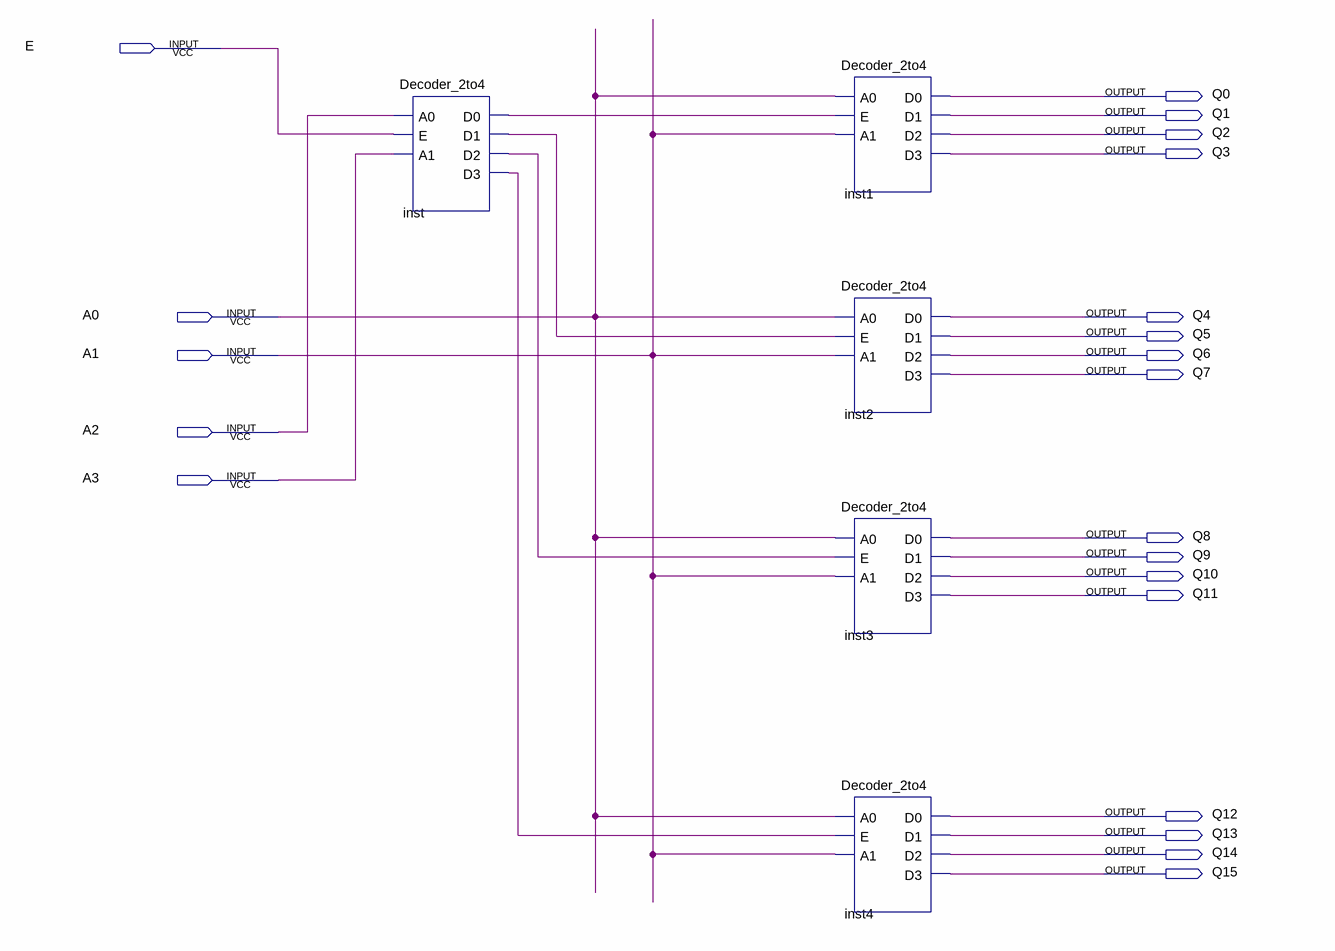
[diagram p0: schematic sheet]
// Quartus schematic Decoder_4to16.bdf as structural Verilog: 5 symbols, 21 pins
module Decoder_4to16 (
  input  E,
  input  A0,
  input  A1,
  input  A2,
  input  A3,
  output Q0,
  output Q1,
  output Q2,
  output Q3,
  output Q4,
  output Q5,
  output Q6,
  output Q7,
  output Q8,
  output Q9,
  output Q10,
  output Q11,
  output Q12,
  output Q13,
  output Q14,
  output Q15
);

  wire inst_d0, inst_d1, inst_d2, inst_d3;

  Decoder_2to4 inst (.A0(A2), .E(E), .A1(A3), .D0(inst_d0), .D1(inst_d1), .D2(inst_d2), .D3(inst_d3));
  Decoder_2to4 inst1 (.A0(A0), .E(inst_d0), .A1(A1), .D0(Q0), .D1(Q1), .D2(Q2), .D3(Q3));
  Decoder_2to4 inst2 (.A0(A0), .E(inst_d1), .A1(A1), .D0(Q4), .D1(Q5), .D2(Q6), .D3(Q7));
  Decoder_2to4 inst3 (.A0(A0), .E(inst_d2), .A1(A1), .D0(Q8), .D1(Q9), .D2(Q10), .D3(Q11));
  Decoder_2to4 inst4 (.A0(A0), .E(inst_d3), .A1(A1), .D0(Q12), .D1(Q13), .D2(Q14), .D3(Q15));
endmodule
